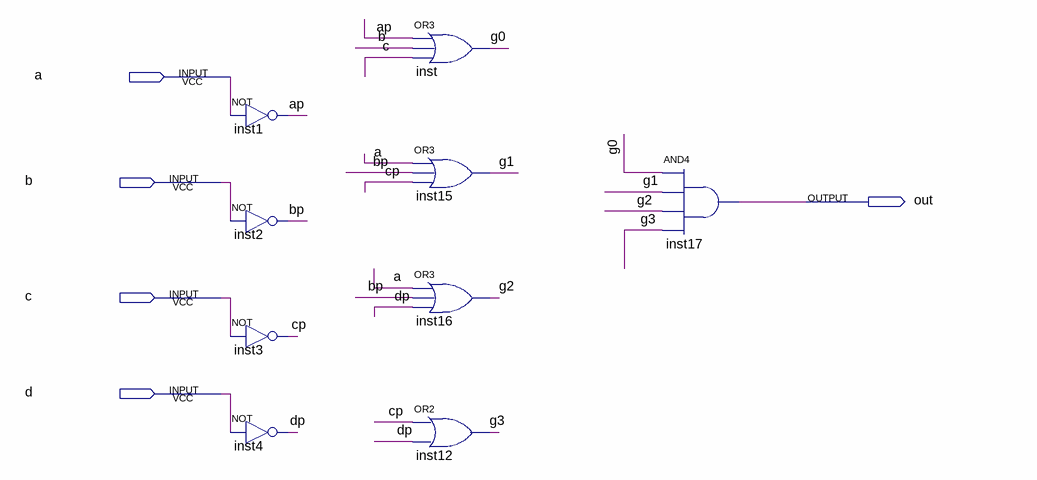
[diagram p0: schematic sheet]
// Quartus schematic POS.bdf as structural Verilog: 9 symbols, 5 pins
module POS (
  input  a,
  input  b,
  input  c,
  input  d,
  output out
);

  wire ap, bp, cp, dp, g0, g1, g2, g3;

  not inst1 (ap, a);
  not inst2 (bp, b);
  not inst3 (cp, c);
  not inst4 (dp, d);
  or inst (g0, ap, b, c);
  or inst15 (g1, a, bp, cp);
  or inst16 (g2, a, bp, dp);
  or inst12 (g3, cp, dp);
  and inst17 (out, g0, g1, g2, g3);
endmodule
